# EAGLE design wolf_rev_d (EAGLE 7.6.0)
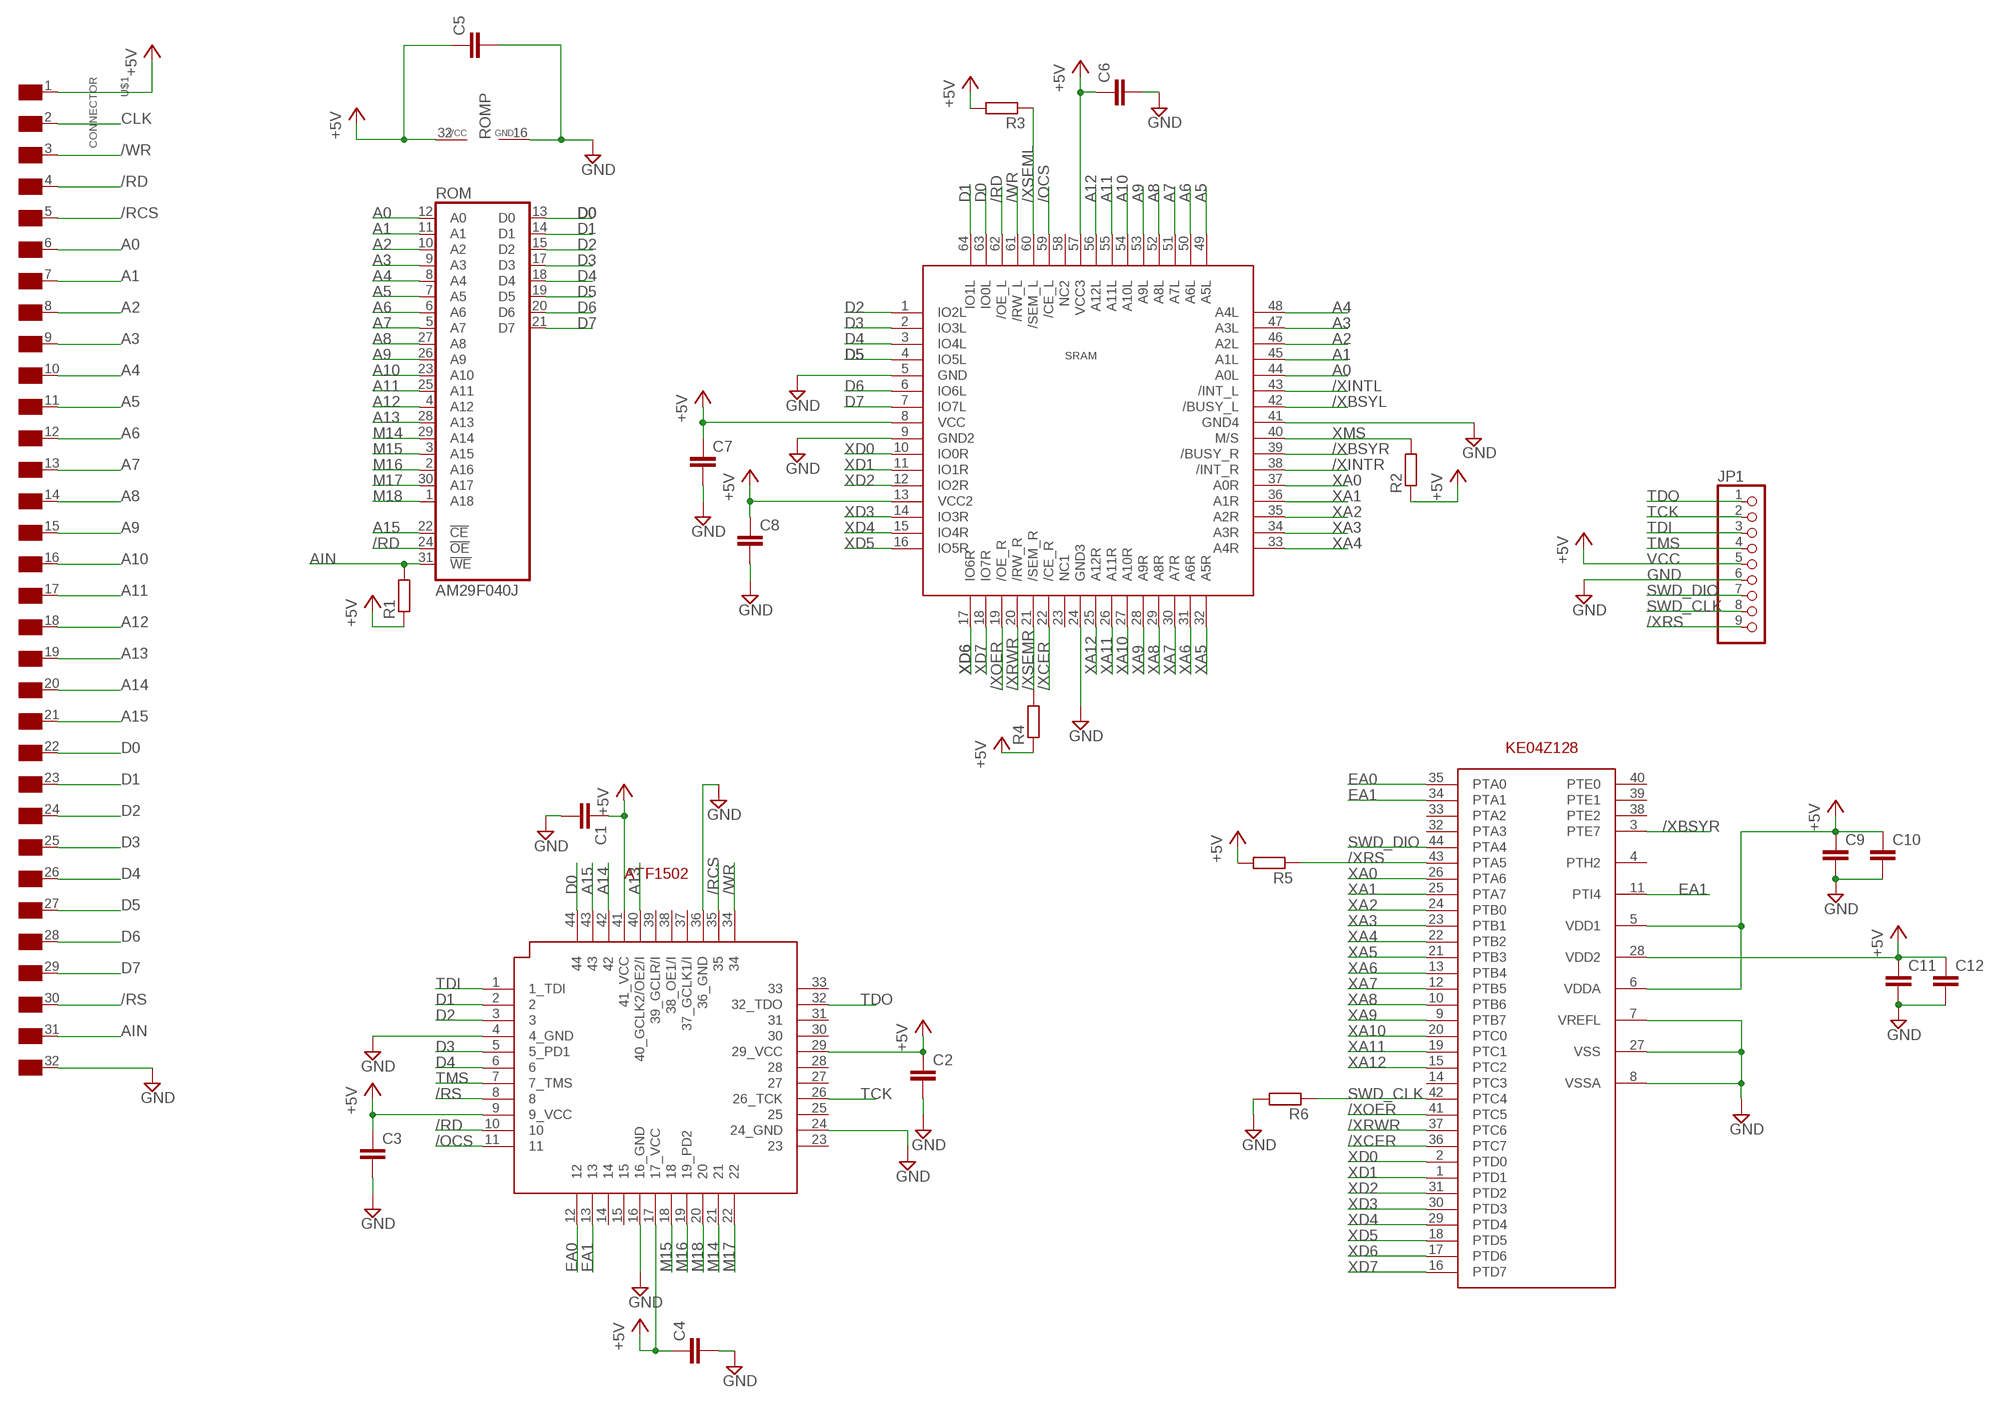
[diagram p0: schematic, sheet 1]

## Parts
ATF1502  ATF1502  [TQFP44]
C1  C-EUC0805  [C0805]
C2  C-EUC0805  [C0805]
C3  C-EUC0805  [C0805]
C4  C-EUC0805  [C0805]
C5  C-EUC0805  [C0805]
C6  C-EUC0805  [C0805]
C7  C-EUC0805  [C0805]
C8  C-EUC0805  [C0805]
C9  C-EUC0805  [C0805]
C10  C-EUC0805  [C0805]
C11  C-EUC0805  [C0805]
C12  C-EUC0805  [C0805]
JP1  PINHD-1X9  [1X09]
KE04Z128  KE04Z128  KE04Z128VLD4  [TQFP44]
R1  R-EU_R0805  [R0805]
R2  R-EU_R0805  [R0805]
R3  R-EU_R0805  [R0805]
R4  R-EU_R0805  [R0805]
R5  R-EU_R0805  [R0805]
R6  R-EU_R0805  [R0805]
ROM  AM29F040J  [PLCC32R]
SRAM  CY7C144E  [TQFP64]
U$1  CONNECTOR  [CONNECTOR]

## Nets
+5V [pwr]: ATF1502.9(9_VCC) ATF1502.17(17_VCC) ATF1502.29(29_VCC) ATF1502.41(41_VCC) C1.1 C2.1 C3.1 C4.1 C5.1 C6.1 C7.1 C8.1 C9.1 C10.1 C11.1 C12.1 JP1.5 KE04Z128.5(VDD1) KE04Z128.6(VDDA) KE04Z128.28(VDD2) R1.1 R2.1 R3.2 R4.1 R5.2 ROM.32(VCC) SRAM.8(VCC) SRAM.13(VCC2) SRAM.57(VCC3) U$1.1(VDD)
/OCS: ATF1502.11 SRAM.59(/CE_L)
/RCS: ATF1502.35 U$1.5(/RCS)
/RD: ATF1502.10 ROM.24(!OE) SRAM.62(/OE_L) U$1.4(/RD)
/RS: ATF1502.8 U$1.30(/RS)
/WR: ATF1502.34 SRAM.61(/RW_L) U$1.3(/WR)
/XBSYL: SRAM.42(/BUSY_L)
/XBSYR: KE04Z128.3(PTE7) SRAM.39(/BUSY_R)
/XCER: KE04Z128.36(PTC7) SRAM.22(/CE_R)
/XINTL: SRAM.43(/INT_L)
/XINTR: SRAM.38(/INT_R)
/XOER: KE04Z128.41(PTC5) SRAM.19(/OE_R)
/XRS: JP1.9 KE04Z128.43(PTA5) R5.1
/XRWR: KE04Z128.37(PTC6) SRAM.20(/RW_R)
/XSEML: R3.1 SRAM.60(/SEM_L)
/XSEMR: R4.2 SRAM.21(/SEM_R)
A0: ROM.12(A0) SRAM.44(A0L) U$1.6(A0)
A1: ROM.11(A1) SRAM.45(A1L) U$1.7(A1)
A2: ROM.10(A2) SRAM.46(A2L) U$1.8(A2)
A3: ROM.9(A3) SRAM.47(A3L) U$1.9(A3)
A4: ROM.8(A4) SRAM.48(A4L) U$1.10(A4)
A5: ROM.7(A5) SRAM.49(A5L) U$1.11(A5)
A6: ROM.6(A6) SRAM.50(A6L) U$1.12(A6)
A7: ROM.5(A7) SRAM.51(A7L) U$1.13(A7)
A8: ROM.27(A8) SRAM.52(A8L) U$1.14(A8)
A9: ROM.26(A9) SRAM.53(A9L) U$1.15(A9)
A10: ROM.23(A10) SRAM.54(A10L) U$1.16(A10)
A11: ROM.25(A11) SRAM.55(A11L) U$1.17(A11)
A12: ROM.4(A12) SRAM.56(A12L) U$1.18(A12)
A13: ATF1502.40(40_GCLK2/OE2/I) ROM.28(A13) U$1.19(A13)
A14: ATF1502.42 U$1.20(A14)
A15: ATF1502.43 ROM.22(!CE) U$1.21(A15)
AIN: R1.2 ROM.31(!WE) U$1.31(VIN)
CLK: U$1.2(NC)
D0: ATF1502.44 ROM.13(D0) SRAM.63(IO0L) U$1.22(D0)
D1: ATF1502.2 ROM.14(D1) SRAM.64(IO1L) U$1.23(D1)
D2: ATF1502.3 ROM.15(D2) SRAM.1(IO2L) U$1.24(D2)
D3: ATF1502.5(5_PD1) ROM.17(D3) SRAM.2(IO3L) U$1.25(D3)
D4: ATF1502.6 ROM.18(D4) SRAM.3(IO4L) U$1.26(D4)
D5: ROM.19(D5) SRAM.4(IO5L) U$1.27(D5)
D6: ROM.20(D6) SRAM.6(IO6L) U$1.28(D6)
D7: ROM.21(D7) SRAM.7(IO7L) U$1.29(D7)
EA0: ATF1502.12 KE04Z128.35(PTA0)
EA1: ATF1502.13 KE04Z128.11(PTI4) KE04Z128.34(PTA1)
GND [gnd]: ATF1502.4(4_GND) ATF1502.16(16_GND) ATF1502.24(24_GND) ATF1502.36(36_GND) C1.2 C2.2 C3.2 C4.2 C5.2 C6.2 C7.2 C8.2 C9.2 C10.2 C11.2 C12.2 JP1.6 KE04Z128.7(VREFL) KE04Z128.8(VSSA) KE04Z128.27(VSS) R6.2 ROM.16(GND) SRAM.5(GND) SRAM.9(GND2) SRAM.24(GND3) SRAM.41(GND4) U$1.32(GND)
M14: ATF1502.21 ROM.29(A14)
M15: ATF1502.18 ROM.3(A15)
M16: ATF1502.19(19_PD2) ROM.2(A16)
M17: ATF1502.22 ROM.30(A17)
M18: ATF1502.20 ROM.1(A18)
SWD_CLK: JP1.8 KE04Z128.42(PTC4) R6.1
SWD_DIO: JP1.7 KE04Z128.44(PTA4)
TCK: ATF1502.26(26_TCK) JP1.2
TDI: ATF1502.1(1_TDI) JP1.3
TDO: ATF1502.32(32_TDO) JP1.1
TMS: ATF1502.7(7_TMS) JP1.4
XA0: KE04Z128.26(PTA6) SRAM.37(A0R)
XA1: KE04Z128.25(PTA7) SRAM.36(A1R)
XA2: KE04Z128.24(PTB0) SRAM.35(A2R)
XA3: KE04Z128.23(PTB1) SRAM.34(A3R)
XA4: KE04Z128.22(PTB2) SRAM.33(A4R)
XA5: KE04Z128.21(PTB3) SRAM.32(A5R)
XA6: KE04Z128.13(PTB4) SRAM.31(A6R)
XA7: KE04Z128.12(PTB5) SRAM.30(A7R)
XA8: KE04Z128.10(PTB6) SRAM.29(A8R)
XA9: KE04Z128.9(PTB7) SRAM.28(A9R)
XA10: KE04Z128.20(PTC0) SRAM.27(A10R)
XA11: KE04Z128.19(PTC1) SRAM.26(A11R)
XA12: KE04Z128.15(PTC2) SRAM.25(A12R)
XD0: KE04Z128.2(PTD0) SRAM.10(IO0R)
XD1: KE04Z128.1(PTD1) SRAM.11(IO1R)
XD2: KE04Z128.31(PTD2) SRAM.12(IO2R)
XD3: KE04Z128.30(PTD3) SRAM.14(IO3R)
XD4: KE04Z128.29(PTD4) SRAM.15(IO4R)
XD5: KE04Z128.18(PTD5) SRAM.16(IO5R)
XD6: KE04Z128.17(PTD6) SRAM.17(IO6R)
XD7: KE04Z128.16(PTD7) SRAM.18(IO7R)
XMS: R2.2 SRAM.40(M/S)
Unconnected: ATF1502.14 ATF1502.15 ATF1502.23 ATF1502.25 ATF1502.27 ATF1502.28 ATF1502.30 ATF1502.31 ATF1502.33 ATF1502.37(37_GCLK1/I) ATF1502.38(38_OE1/I) ATF1502.39(39_GCLR/I) KE04Z128.4(PTH2) KE04Z128.14(PTC3) KE04Z128.32(PTA3) KE04Z128.33(PTA2) KE04Z128.38(PTE2) KE04Z128.39(PTE1) KE04Z128.40(PTE0) SRAM.23(NC1) SRAM.58(NC2)

## Notes on the sheet
- VCC
- GND

## Library data of the parts
ATF1502 = wolf_rev_d:ATF1502
C1-C12 = resistor:C-EU: CAPACITOR, European symbol
JP1 = pinhead:PINHD-1X9: PIN HEADER
KE04Z128 = wolf_rev_c:KE04Z128VLD4
R1-R6 = resistor:R-EU_: RESISTOR, European symbol
ROM = am29-memory:AM29F040J: 4-Megabit FLASH MEMORY (512 K x 8 bit) 5 V-only
SRAM = wolf_rev_c:CY7C144E
U$1 = gameboy:CONNECTOR: Connector Pads for Gameboy Cartridges

## Net classes
1 pwr: width 0.406 mm
2 gnd: width 0.406 mm

## Board
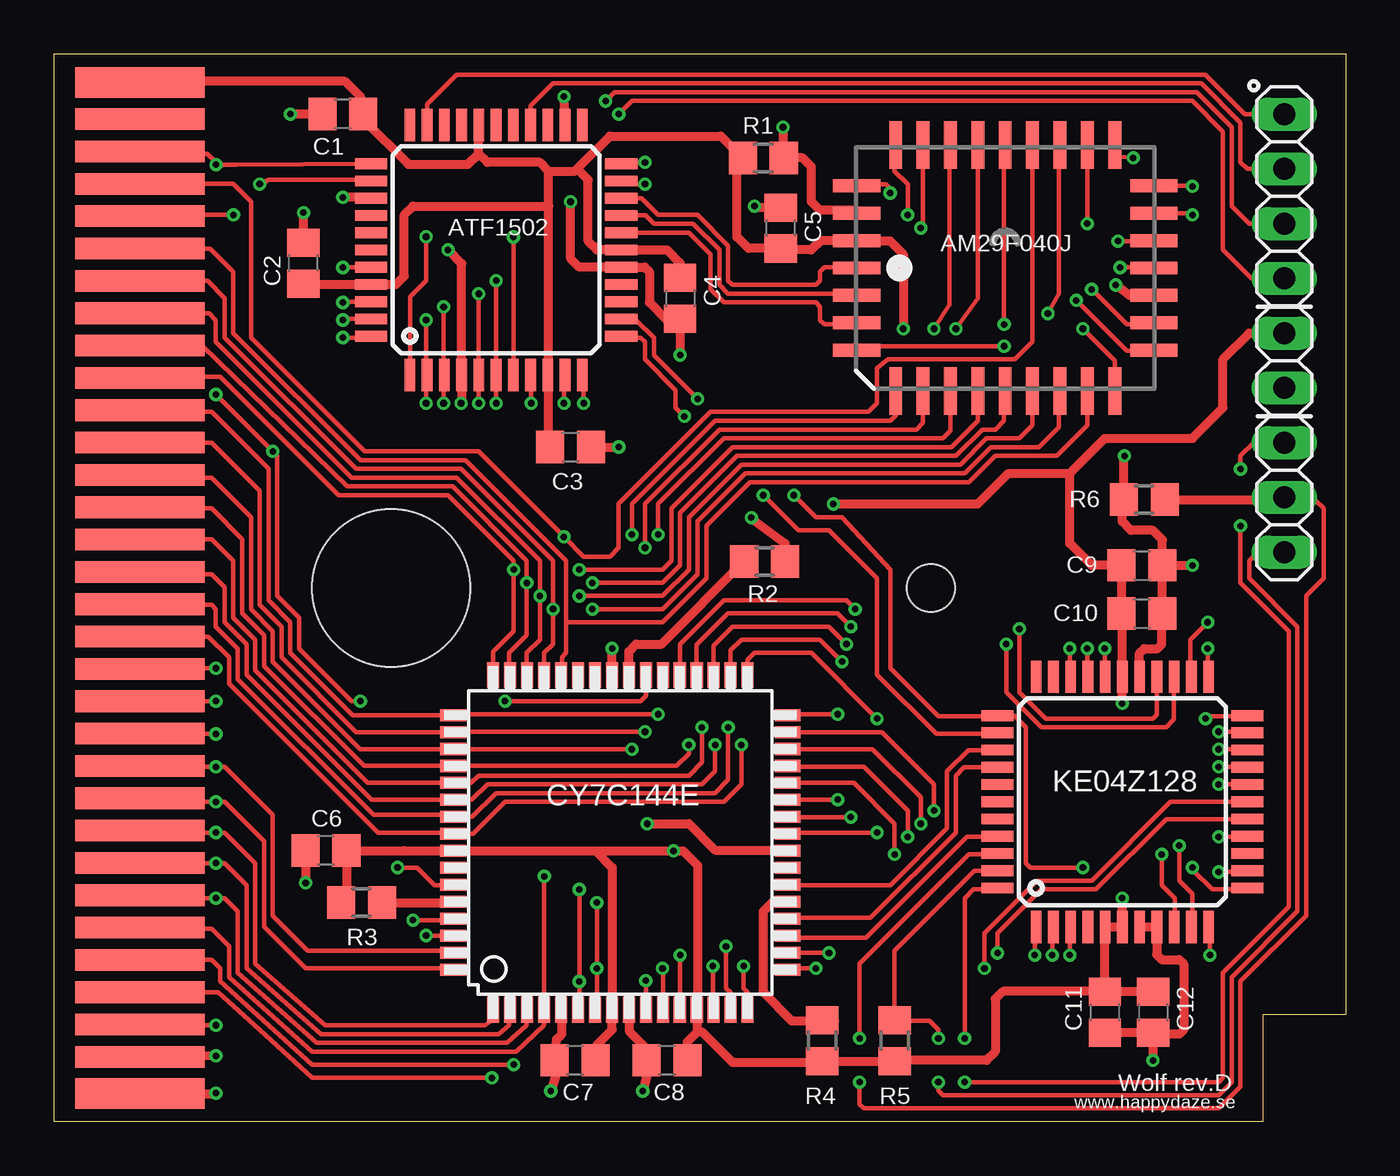
[diagram p1: board, top side]
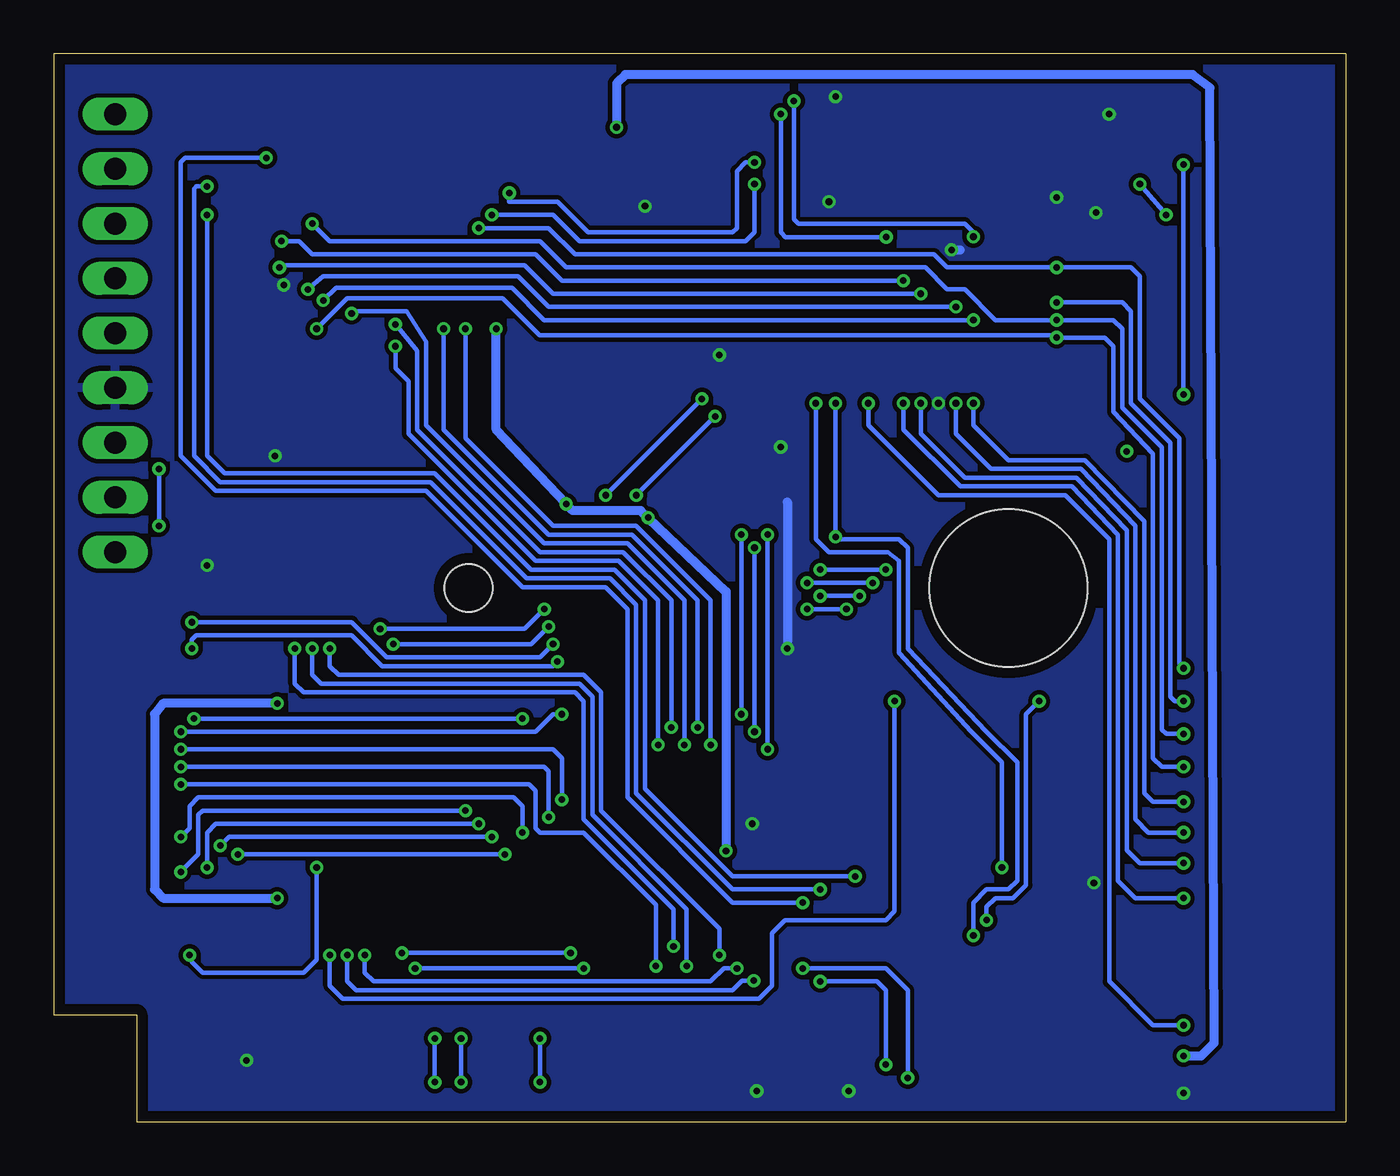
[diagram p2: board, bottom side, seen from below]

Size 59.94 x 49.53 mm. Coordinates in mm from the lower left corner, seen from the top.
Outline: 59.94,4.95 56.11,4.95 56.11,0 0,0 0,49.53 59.94,49.53 59.94,4.95
Copper layers (1*16): Top 0.035mm / dielectric 1.6mm / Bottom 0.035mm
Design rules "Elecrow_2-layer_PCB_eagle_rule *": minimum track width 8mil, minimum drill 12mil, track to track 8mil, track to pad 8mil, pad to pad 8mil, via to via 8mil, smd to smd 0mil, copper to edge 20mil, drill to drill 10mil, minimum pad ring 6mil, minimum via ring 6mil, stop-mask expansion 0mil, vias tented up to drill 100mil, thermal gap 10mil
Holes 7.3 mm at 15.65,24.75
Holes 2.2 mm at 40.7,24.75

### Footprints (pad centres in the part's own frame; a part is rotated, then mirrored left to right if it is on the bottom)
TQFP44 = smd 1.5 x 0.5: 1 -5.8,4; 2 -5.8,3.2; 3 -5.8,2.4; 4 -5.8,1.6; 5 -5.8,0.8; 6 -5.8,0; 7 -5.8,-0.8; 8 -5.8,-1.6; 9 -5.8,-2.4; 10 -5.8,-3.2; 11 -5.8,-4; 23 5.8,-4; 24 5.8,-3.2; 25 5.8,-2.4; 26 5.8,-1.6; 27 5.8,-0.8; 28 5.8,0; 29 5.8,0.8; 30 5.8,1.6; 31 5.8,2.4; 32 5.8,3.2; 33 5.8,4 | smd 0.5 x 1.5: 12 -4,-5.8; 13 -3.2,-5.8; 14 -2.4,-5.8; 15 -1.6,-5.8; 16 -0.8,-5.8; 17 0,-5.8; 18 0.8,-5.8; 19 1.6,-5.8; 20 2.4,-5.8; 21 3.2,-5.8; 22 4,-5.8; 34 4,5.8; 35 3.2,5.8; 36 2.4,5.8; 37 1.6,5.8; 38 0.8,5.8; 39 0,5.8; 40 -0.8,5.8; 41 -1.6,5.8; 42 -2.4,5.8; 43 -3.2,5.8; 44 -4,5.8
C0805 = smd 1.3 x 1.5: 1 -0.95,0; 2 0.95,0
1X09 = drill 1.016 long: 1 -10.16,0; 2 -7.62,0; 3 -5.08,0; 4 -2.54,0; 5 0,0; 6 2.54,0; 7 5.08,0; 8 7.62,0; 9 10.16,0
R0805 = smd 1.3 x 1.5: 1 -0.95,0; 2 0.95,0
PLCC32R = smd 0.6 x 2.2: 1 0,6.9; 2 -1.27,6.9; 3 -2.54,6.9; 4 -3.81,6.9; 14 -3.81,-6.9; 15 -2.54,-6.9; 16 -1.27,-6.9; 17 0,-6.9; 18 1.27,-6.9; 19 2.54,-6.9; 20 3.81,-6.9; 30 3.81,6.9; 31 2.54,6.9; 32 1.27,6.9 | smd 2.2 x 0.6: 5 -5.7,5.08; 6 -5.7,3.81; 7 -5.7,2.54; 8 -5.7,1.27; 9 -5.7,0; 10 -5.7,-1.27; 11 -5.7,-2.54; 12 -5.7,-3.81; 13 -5.7,-5.08; 21 5.7,-5.08; 22 5.7,-3.81; 23 5.7,-2.54; 24 5.7,-1.27; 25 5.7,0; 26 5.7,1.27; 27 5.7,2.54; 28 5.7,3.81; 29 5.7,5.08
TQFP64 = smd 1.194 x 0.559: 1 -7.76,5.905; 2 -7.76,5.118; 3 -7.76,4.331; 4 -7.76,3.543; 5 -7.76,2.756; 6 -7.76,1.968; 7 -7.76,1.181; 8 -7.76,0.394; 9 -7.76,-0.394; 10 -7.76,-1.181; 11 -7.76,-1.968; 12 -7.76,-2.756; 13 -7.76,-3.543; 14 -7.76,-4.331; 15 -7.76,-5.118; 16 -7.76,-5.905; 33 7.76,-5.905; 34 7.76,-5.118; 35 7.76,-4.331; 36 7.76,-3.543; 37 7.76,-2.756; 38 7.76,-1.968; 39 7.76,-1.181; 40 7.76,-0.394; 41 7.76,0.394; 42 7.76,1.181; 43 7.76,1.968; 44 7.76,2.756; 45 7.76,3.543; 46 7.76,4.331; 47 7.76,5.118; 48 7.76,5.905 | smd 0.559 x 1.194: 17 -5.905,-7.76; 18 -5.118,-7.76; 19 -4.331,-7.76; 20 -3.543,-7.76; 21 -2.756,-7.76; 22 -1.968,-7.76; 23 -1.181,-7.76; 24 -0.394,-7.76; 25 0.394,-7.76; 26 1.181,-7.76; 27 1.968,-7.76; 28 2.756,-7.76; 29 3.543,-7.76; 30 4.331,-7.76; 31 5.118,-7.76; 32 5.905,-7.76; 49 5.905,7.76; 50 5.118,7.76; 51 4.331,7.76; 52 3.543,7.76; 53 2.756,7.76; 54 1.968,7.76; 55 1.181,7.76; 56 0.394,7.76; 57 -0.394,7.76; 58 -1.181,7.76; 59 -1.968,7.76; 60 -2.756,7.76; 61 -3.543,7.76; 62 -4.331,7.76; 63 -5.118,7.76; 64 -5.905,7.76
CONNECTOR = smd 1.4 x 6: 1 0.7,-3; 32 47.6,-3 | smd 1 x 6: 2 2.4,-3; 3 3.9,-3; 4 5.4,-3; 5 6.9,-3; 6 8.4,-3; 7 9.9,-3; 8 11.4,-3; 9 12.9,-3; 10 14.4,-3; 11 15.9,-3; 12 17.4,-3; 13 18.9,-3; 14 20.4,-3; 15 21.9,-3; 16 23.4,-3; 17 24.9,-3; 18 26.4,-3; 19 27.9,-3; 20 29.4,-3; 21 30.9,-3; 22 32.4,-3; 23 33.9,-3; 24 35.4,-3; 25 36.9,-3; 26 38.4,-3; 27 39.9,-3; 28 41.4,-3; 29 42.9,-3; 30 44.4,-3; 31 45.9,-3

### Placement (x,y rotation side)
ATF1502  20.52,40.44 90 top
C1  13.41,46.74 180 top
C2  11.58,39.83 90 top
C3  23.98,31.29 0 top
C4  29.06,38.2 270 top
C5  33.73,41.45 90 top
C6  12.62,12.57 180 top
C7  24.18,2.84 180 top
C8  28.45,2.84 180 top
C9  50.5,25.81 0 top
C10  50.5,23.57 0 top
C11  48.77,5.08 270 top
C12  51,5.08 270 top
JP1  57.1,36.58 270 top
KE04Z128  49.58,14.83 90 top
R1  32.92,44.7 0 top
R2  32.99,25.99 180 top
R3  14.27,10.16 180 top
R4  35.66,3.76 90 top
R5  39.01,3.76 270 top
R6  50.6,28.85 180 top
ROM  44.15,39.6 90 top
SRAM  26.29,12.95 90 top
U$1  7,48.9 270 top

### Tracks (layer width: path | path; a pad name or v marks a point on that pad's centre or on a via)
+5V  (via drill 0.3 pad 0.3)
  Top 0.406: C7.1 25.21,3.57 25.91,4.27 SRAM.8 25.91,5.21 25.91,11.79 25.13,12.56 | C8.1 29.4,3.69 29.87,4.17 | 29.87,4.17 29.87,5.16 SRAM.13 29.87,5.23 29.87,11.89 29.2,12.56 v28.75,12.56 25.13,12.56 | 16.26,12.57 C6.1 13.57,9.81 R3.2 | 16.26,12.57 18.52,12.57 SRAM.57 25.13,12.56 | 16.24,12.56 16.26,12.57 | v36.17,28.65 42.88,28.65 44.3,30.07 47.14,30.07 | v32.37,28.02 32.33,28.02 33.93,26.82 R2.1 | 29.87,4.17 30.07,4.17 31.5,2.74 36.2,2.74 R4.1 R5.2 39.66,2.85 43.28,2.85 43.69,3.25 43.69,5.69 44.04,6.04 48.78,6.04 | C9.1 C10.1 49.58,23.54 KE04Z128.28 | C12.1 C11.1 48.78,6.04 | 49.58,25.84 C9.1 | JP1.5 55.47,36.58 54.25,35.36 54.25,33.12 52.83,31.7 48.77,31.7 47.14,30.07 | 49.55,20.67 KE04Z128.28 | v49.58,19.41 KE04Z128.28 | KE04Z128.6 49.58,8.94 | KE04Z128.6 KE04Z128.5 48.78,6.04 | KE04Z128.6 v49.58,10.36 | v39.42,36.78 39.42,40.23 38.81,40.84 37.27,40.84 ROM.32 35.59,40.87 35.15,40.44 34,40.44 C5.1 32.24,40.5 31.7,41.05 31.7,44.64 R1.1 30.95,45.72 25.81,45.72 24.28,44.2 | C2.1 11.65,38.81 14.63,38.81 14.66,38.84 ATF1502.41 15.88,38.84 16.26,39.22 16.26,42.06 16.66,42.47 22.96,42.47 | C3.1 22.92,31.4 ATF1502.9 22.96,34.67 22.96,42.47 | C4.1 29.06,39.83 28.45,40.44 ATF1502.17 25.2,40.44 24.79,40.84 24.79,43.69 24.28,44.2 | 19.71,44.91 19.71,46.22 ATF1502.29 | 19.71,44.91 20.12,44.5 22.55,44.5 22.96,44.09 | 22.96,42.47 22.96,44.09 | U$1.1 4.06,48.26 13.51,48.26 14.22,47.55 14.22,46.87 C1.1 14.36,46.5 16.46,44.4 19.2,44.4 19.71,44.91 | 22.96,44.09 24.18,44.09 24.28,44.2 | C9.1 48.16,25.81 47.14,26.82 47.14,30.07
  Bottom 0.406: v28.75,12.56 28.75,24.59 v32.37,28.02 32.72,28.35 35.87,28.35 v36.17,28.65 39.42,32.11 v39.42,36.78 | v49.58,19.41 54.86,19.41 55.27,18.9 55.27,10.77 54.86,10.36 v49.58,10.36
/OCS  (via drill 0.3 pad 0.3)
  Top 0.203: SRAM.59 18.52,10.97 17.68,10.97 16.87,11.79 v15.95,11.79 | v24.59,33.33 24.59,34.57 ATF1502.11
  Bottom 0.203: v15.95,11.79 15.95,16.66 17.37,18.09 20.73,21.74 20.73,26.01 21.23,26.42 23.98,26.42 24.59,27.03 v24.59,33.33
/RCS  (via drill 0.3 pad 0.3)
  Top 0.203: v8.33,42.06 4.06,42.06 U$1.5 | v9.55,43.48 9.96,43.69 14.67,43.69 ATF1502.35
  Bottom 0.203: v8.33,42.06 v9.55,43.48
/RD  (via drill 0.3 pad 0.3)
  Top 0.203: U$1.4 8.32,43.5 9.14,42.67 9.14,36.37 14.43,31.09 19.71,31.09 v23.67,27.13 24.59,26.21 25.81,26.21 26.21,26.62 26.21,28.65 30.48,32.92 37.8,32.92 38.2,33.33 38.2,34.95 38.71,35.36 44.6,35.36 45.41,36.17 ROM.24 | SRAM.62 17.29,8.62 v17.27,8.64 | v23.67,33.33 23.67,34.59 ATF1502.10
  Bottom 0.203: v17.27,8.64 17.27,10.16 16.66,10.77 15.65,10.77 15.24,11.18 15.24,16.66 16.66,18.09 20.32,21.95 20.32,26.62 20.73,27.03 23.57,27.03 v23.67,27.13 v23.67,33.33
/RS  (via drill 0.3 pad 0.3)
  Top 0.203: v22.15,33.33 22.15,34.61 ATF1502.8 | v7.52,4.47 4.03,4.47 U$1.30
  Bottom 0.203: v7.52,4.47 8.94,4.47 10.97,6.5 10.97,27.03 13.01,29.06 18.9,29.06 22.15,32.31 v22.15,33.33
/WR  (via drill 0.3 pad 0.3)
  Top 0.203: v7.52,33.73 v10.16,31.09 10.36,30.89 10.36,24.38 11.38,23.37 11.38,21.95 13.82,19.51 v14.22,19.51 | v16.66,9.35 18.47,9.35 SRAM.61 | ATF1502.34 8.47,44.39 v7.53,44.39 7.53,44.49 7.11,44.91 4.09,44.91 U$1.3
  Bottom 0.203: v7.53,44.39 7.53,33.52 v7.52,33.73 | v16.66,9.35 16.66,9.96 16.26,10.36 15.44,10.36 14.83,10.97 14.83,18.9 v14.22,19.51
/XBSYR  (via drill 0.3 pad 0.3)
  Top 0.203: v47.14,7.72 47.14,8.99 KE04Z128.3 | SRAM.39 27.47,19.75 27.23,19.51 v20.93,19.51
  Bottom 0.203: v47.14,7.72 47.14,6.3 46.53,5.69 27.23,5.69 26.62,6.3 26.62,8.74 26.01,9.35 21.34,9.35 20.93,9.75 v20.93,19.51
/XCER
  Top 0.203: KE04Z128.36 42.43,17.23 41.45,16.26 41.45,13.61 38.81,10.97 34.06,10.97 SRAM.22
/XOER
  Top 0.203: SRAM.19 34.14,8.53 37.69,8.53 42.37,13.21 43.76,13.21 KE04Z128.41
/XRS  (via drill 0.3 pad 0.3)
  Top 0.203: KE04Z128.43 42.72,11.63 39.01,7.92 R5.1 39.05,4.67 40.64,4.67 41.05,4.27 v41.05,3.86 | JP1.9 55.88,26.42 55.47,26.01 55.47,25.2 57.71,22.96 57.71,9.75 54.66,6.71 54.66,1.83 54.05,1.22 41.25,1.22 41.05,1.42 v41.05,1.83
  Bottom 0.203: v41.05,1.83 v41.05,3.86
/XRWR
  Top 0.203: KE04Z128.37 42.24,16.43 41.86,16.05 41.86,13.41 37.9,9.45 34.09,9.45 SRAM.20 34.11,9.35
/XSEML
  Top 0.406: R3.1 18.49,10.16 SRAM.60
/XSEMR
  Top 0.406: SRAM.21 34.01,10.16 33.33,10.16 32.92,9.75 32.92,5.99 34.24,4.67 36.24,4.67 R4.2
A0
  Top 0.203: U$1.6 7.25,40.5 8.33,39.42 8.33,36.58 14.22,30.68 19.1,30.68 23.77,26.01 23.77,23.16 | SRAM.44 23.57,20.75 23.57,21.54 23.77,21.74 23.77,23.16 | ROM.12 47.95,32.31 46.53,30.89 43.69,30.89 42.47,29.67 32.31,29.67 30.28,27.64 30.28,25.2 28.25,23.16 23.77,23.16
A1  (via drill 0.3 pad 0.3)
  Top 0.203: U$1.7 7.13,39 7.92,38.2 7.92,36.37 14.02,30.28 18.9,30.28 23.16,26.01 v23.16,23.77 23.16,22.15 22.76,21.74 22.76,20.73 SRAM.45 | ROM.11 46.63,33.85 46.63,32.21 45.72,31.29 43.48,31.29 42.27,30.07 32.11,30.07 29.87,27.84 29.87,25.4 28.25,23.77 v24.99,23.77
  Bottom 0.203: v23.16,23.77 v24.99,23.77
A2  (via drill 0.3 pad 0.3)
  Top 0.203: U$1.8 7.2,37.5 7.52,37.19 7.52,36.17 13.82,29.87 18.69,29.87 22.55,26.01 v22.55,24.38 22.55,22.35 21.95,21.74 21.95,20.73 SRAM.46 | ROM.10 45.41,32.31 44.81,31.7 43.28,31.7 42.06,30.48 31.9,30.48 29.46,28.04 29.46,25.6 28.25,24.38 v24.38,24.38
  Bottom 0.203: v22.55,24.38 v24.38,24.38
A3  (via drill 0.3 pad 0.3)
  Top 0.203: U$1.9 6.88,36 13.61,29.46 18.49,29.46 21.95,26.01 v21.95,24.99 21.95,22.55 21.13,21.74 21.13,20.75 SRAM.47 | ROM.9 44.09,33.85 44.09,32.51 43.69,32.11 43.08,32.11 41.86,30.89 31.7,30.89 29.06,28.25 29.06,25.81 28.25,24.99 v24.99,24.99
  Bottom 0.203: v21.95,24.99 v24.99,24.99
A4  (via drill 0.3 pad 0.3)
  Top 0.203: U$1.10 4.04,34.54 7.72,34.54 13.21,29.06 18.29,29.06 21.34,26.01 v21.34,25.6 21.34,22.76 20.38,21.81 SRAM.48 | ROM.8 42.88,32.51 41.66,31.29 31.5,31.29 28.65,28.45 28.65,26.01 28.25,25.6 v24.38,25.6
  Bottom 0.203: v21.34,25.6 v24.38,25.6
A5  (via drill 0.3 pad 0.3)
  Top 0.203: U$1.11 4.08,32.92 7.32,32.92 9.96,30.28 9.96,24.18 10.97,23.16 10.97,21.74 13.86,18.86 SRAM.49 18.57,18.9 v28.04,18.9 | ROM.7 41.6,32.05 41.25,31.7 31.09,31.7 28.04,28.65 v28.04,27.23
  Bottom 0.203: v28.04,27.23 v28.04,18.9
A6  (via drill 0.3 pad 0.3)
  Top 0.203: U$1.12 7.32,31.5 9.55,29.26 9.55,23.98 10.57,22.96 10.57,21.54 14.03,18.07 SRAM.50 18.54,18.09 v27.43,18.09 | ROM.6 40.34,32.41 40.03,32.11 30.89,32.11 27.43,28.65 v27.43,26.62
  Bottom 0.203: v27.43,26.62 v27.43,18.09
A7  (via drill 0.3 pad 0.3)
  Top 0.203: U$1.13 4.13,29.87 7.32,29.87 9.14,28.04 9.14,23.77 10.16,22.76 10.16,21.34 14.21,17.29 SRAM.51 18.54,17.27 v26.82,17.27 | ROM.5 39.06,32.77 38.81,32.51 30.68,32.51 26.82,28.65 v26.82,27.23
  Bottom 0.203: v26.82,27.23 v26.82,17.27
A8  (via drill 0.3 pad 0.3)
  Top 0.203: 3.95,28.45 7.32,28.45 8.74,27.03 8.74,23.57 9.75,22.55 9.75,21.13 14.39,16.5 SRAM.52 28.89,16.5 29.46,17.07 v29.46,17.48 | 3.45,28.45 3.95,28.45 | 3.95,28.45 U$1.14 | v40.84,36.78 41.55,37.9 41.55,45.25 ROM.27
  Bottom 0.203: v29.46,17.48 29.46,24.18 32.92,27.64 36.78,27.64 40.84,31.7 v40.84,36.78
A9  (via drill 0.3 pad 0.3)
  Top 0.203: U$1.15 4.03,27.03 7.32,27.03 8.33,26.01 8.33,23.37 9.35,22.35 9.35,20.93 14.57,15.71 SRAM.53 19.37,15.71 19.71,16.05 29.46,16.05 30.07,16.66 v30.07,18.29 | v41.86,36.78 42.88,38.2 ROM.26
  Bottom 0.203: v30.07,18.29 30.07,24.18 33.12,27.23 36.98,27.23 41.86,32.11 v41.86,36.78
A10  (via drill 0.3 pad 0.3)
  Top 0.203: U$1.16 4.1,25.4 7.32,25.4 7.92,24.79 7.92,23.16 8.94,22.15 8.94,20.73 14.74,14.92 SRAM.54 19.39,14.92 20.12,15.65 30.07,15.65 30.68,16.26 v30.68,17.48 | v46.13,37.49 46.63,38.41 46.63,45.25 ROM.23 46.74,45.25
  Bottom 0.203: v30.68,17.48 30.68,24.18 33.33,26.82 37.19,26.82 42.67,32.31 42.67,36.17 43.59,37.59 46.02,37.59 v46.13,37.49
A11  (via drill 0.3 pad 0.3)
  Top 0.203: U$1.17 4.02,23.98 7.32,23.98 7.52,23.77 7.52,22.96 8.53,21.95 8.53,20.52 14.83,14.22 18.44,14.22 SRAM.55 19.42,14.13 20.52,15.24 30.68,15.24 31.29,15.85 v31.29,18.29 | v44.09,36.98 44.09,45.25 ROM.25
  Bottom 0.203: v31.29,18.29 31.29,24.18 33.53,26.42 37.39,26.42 43.08,32.11 43.08,35.76 v44.09,36.98
A12  (via drill 0.3 pad 0.3)
  Top 0.203: U$1.18 7.17,22.5 8.13,21.54 8.13,20.32 15.04,13.41 18.47,13.41 SRAM.56 19.44,13.35 20.93,14.83 31.09,14.83 31.9,15.65 v31.9,17.48 | v44.09,35.97 38,35.97 37.8,35.76 37.27,35.76 ROM.4
  Bottom 0.203: v31.9,17.48 31.9,24.18 33.73,26.01 37.59,26.01 43.48,31.9 43.48,34.34 44.09,34.95 v44.09,35.97
A13  (via drill 0.3 pad 0.3)
  Top 0.203: v7.52,21.03 4.03,21.03 U$1.19 | ATF1502.40 13.42,39.64 v13.41,39.62 | ROM.28 40.34,41.55 v40.23,41.45
  Bottom 0.203: v7.52,21.03 7.72,21.23 7.72,31.7 9.55,33.53 9.55,39.22 9.96,39.62 v13.41,39.62 18.49,39.62 19.1,40.23 35.76,40.23 36.98,41.45 v40.23,41.45
A14  (via drill 0.3 pad 0.3)
  Top 0.203: v7.52,19.51 U$1.20 | ATF1502.42 13.65,38.04 v13.41,38
  Bottom 0.203: v7.52,19.51 7.92,19.51 8.13,19.71 8.13,31.5 9.96,33.33 9.96,37.59 10.36,38 v13.41,38
A15  (via drill 0.3 pad 0.3)
  Top 0.203: v7.52,17.98 4.02,17.98 U$1.21 | v13.41,37.19 13.67,37.24 ATF1502.43 14.77,37.19 | ROM.22 v47.95,41.66
  Bottom 0.203: v7.52,17.98 8.33,17.98 8.53,18.19 8.53,31.29 10.36,33.12 10.36,36.78 10.77,37.19 v13.41,37.19 16.26,37.19 17.68,38.61 18.49,38.61 19.51,39.62 36.17,39.62 37.39,40.84 47.14,40.84 v47.95,41.66
AIN  (via drill 0.3 pad 0.3)
  Top 0.203: 37.12,42.27 ROM.31
  Top 0.406: 37.22,42.16 ROM.31 | v7.52,3.05 7.5,3.05 U$1.31 | v33.83,46.13 33.83,44.74 R1.2 34.75,44.7 35.15,44.3 35.15,42.67 35.56,42.27 37.12,42.27
  Bottom 0.406: v7.52,3.05 7.5,3.03 6.71,3.03 6.1,3.65 6.3,47.95 7.11,48.56 33.43,48.56 33.83,48.16 v33.83,46.13
D0  (via drill 0.3 pad 0.3)
  Top 0.203: SRAM.63 18.44,7.92 11.79,7.92 10.16,9.55 10.16,14.22 7.92,16.46 v7.52,16.46 4.04,16.46 U$1.22 | ROM.13 49.23,35.31 v47.75,36.78 | v13.41,36.37 14.66,36.37 ATF1502.44
  Bottom 0.203: v7.52,16.46 8.53,16.46 8.94,16.87 8.94,30.99 10.77,32.92 10.77,35.97 11.18,36.37 v13.41,36.37 13.52,36.48 37.41,36.48 39.12,38.19 39.73,38.2 46.33,38.2 v47.75,36.78
D1  (via drill 0.3 pad 0.3)
  Top 0.203: SRAM.64 18.47,7.11 11.68,7.11 9.75,9.04 9.75,13.01 7.92,14.83 v7.52,14.83 4.17,14.83 U$1.23 | v47.45,38.1 49.78,35.76 51.02,35.76 ROM.14 | v17.27,33.33 17.27,34.59 ATF1502.2 17.27,34.69 v17.27,37.19
  Bottom 0.203: v7.52,14.83 8.94,14.83 9.35,15.24 9.35,27.84 12.09,30.68 15.65,30.68 17.27,32.31 v17.27,33.33 | v17.27,37.19 37.19,37.19 38.69,38.69 46.86,38.69 v47.45,38.1
D2  (via drill 0.3 pad 0.3)
  Top 0.203: SRAM.1 20.32,5.13 20.32,4.67 20.02,4.47 12.6,4.47 9.35,7.32 9.35,11.99 7.92,13.41 v7.52,13.41 4.09,13.41 U$1.24 | ROM.15 50.97,36.98 49.78,36.98 v48.16,38.61 | v18.09,33.33 18.09,34.6 ATF1502.3 18.09,34.67 v18.09,37.8
  Bottom 0.203: v7.52,13.41 9.14,13.41 9.75,14.02 9.75,27.64 12.29,30.28 16.46,30.28 18.09,31.9 v18.09,33.33 | v48.16,38.61 47.45,39.22 38.41,39.22 36.98,37.8 v18.09,37.8
D3  (via drill 0.3 pad 0.3)
  Top 0.203: SRAM.2 21.13,5.16 21.13,4.47 20.62,4.06 12.39,4.06 8.94,7.11 8.94,10.97 7.92,11.99 v7.52,11.99 U$1.25 | v49.48,39.62 51.02,39.62 ROM.17 | v19.71,33.33 19.71,34.62 ATF1502.5 v19.71,38.41
  Bottom 0.203: v7.52,11.99 9.55,11.99 10.16,12.6 10.16,27.43 12.5,29.87 17.68,29.87 19.71,31.9 v19.71,33.33 | v49.48,39.62 49.38,39.62 49.17,39.73 38.1,39.73 36.78,38.41 v19.71,38.41
D4  (via drill 0.3 pad 0.3)
  Top 0.203: SRAM.3 21.95,5.18 21.95,4.47 21.03,3.66 12.19,3.66 8.53,6.91 8.53,9.75 7.92,10.36 v7.52,10.36 4.14,10.36 U$1.26 | 50.62,40.87 ROM.18 51.02,40.84 v49.38,40.84 | v20.52,33.33 ATF1502.6 v20.52,39.01
  Bottom 0.203: v7.52,10.36 9.75,10.36 10.57,11.18 10.57,27.23 12.7,29.46 17.88,29.46 20.52,32.11 v20.52,33.33 | v49.38,40.84 48.56,40.84 47.95,40.23 37.59,40.23 36.37,39.01 v20.52,39.01
D5  (via drill 0.3 pad 0.3)
  Top 0.203: U$1.27 4.21,9 4.27,8.94 7.32,8.94 8.13,8.13 8.13,6.71 11.99,3.25 21.44,3.25 22.76,4.47 SRAM.4 22.76,5.21 v22.76,11.38 | ROM.19 52.76,42.14 v52.83,42.06
  Bottom 0.203: v52.83,42.06 52.83,30.89 52.02,30.07 42.27,30.07 37.8,25.6 33.93,25.6 32.51,24.18 32.51,15.44 28.45,11.38 v22.76,11.38
D6  (via drill 0.3 pad 0.3, 0.3 pad 0.61)
  Top 0.203: U$1.28 7.33,7.5 7.72,7.11 7.72,6.5 11.99,2.64 v21.34,2.64 | ROM.20 52.81,43.41 v52.83,43.38 | SRAM.6 24.38,5.26 v24.38,6.5 v24.38,10.77
  Bottom 0.203: v21.34,2.64 21.34,6.1 21.74,6.5 v24.38,6.5 | v52.83,43.38 53.34,43.38 53.44,43.28 53.44,30.89 52.22,29.67 42.47,29.67 38,25.2 34.14,25.2 32.92,23.98 32.92,15.24 28.45,10.77 v24.38,10.77
D7  (via drill 0.3 pad 0.3, 0.3 pad 0.61)
  Top 0.203: U$1.29 7.61,6 9.55,4.27 11.99,2.03 v20.32,2.03 | 25.09,5.21 SRAM.7 25.2,5.28 v25.2,7.11 v25.2,10.16 | ROM.21 49.43,44.76 v50.09,44.7
  Bottom 0.203: v20.32,2.03 20.32,6.1 21.34,7.11 v25.2,7.11 | v50.09,44.7 53.85,44.7 54.05,44.5 54.05,30.89 52.43,29.26 42.67,29.26 38.2,24.79 34.34,24.79 33.33,23.77 33.33,15.04 28.45,10.16 v25.2,10.16
EA0  (via drill 0.3 pad 0.3)
  Top 0.203: v32.92,29.06 34.54,27.43 35.97,27.43 38.2,25.2 38.2,20.73 40.95,17.98 43.73,17.98 KE04Z128.35 | ATF1502.12 26.39,36.37 27.23,36.37 27.43,36.17 27.43,35.36 28.85,33.93 28.85,33.12 v29.26,32.72
  Bottom 0.203: v32.92,29.06 v29.26,32.72
EA1  (via drill 0.3 pad 0.3)
  Top 0.203: v34.34,29.06 35.36,28.04 36.58,28.04 38.81,25.6 38.81,21.03 41.05,18.8 43.74,18.8 KE04Z128.34 44.56,18.83 45.11,18.29 45.11,11.99 45.31,11.79 v47.75,11.79 | v53.65,7.72 53.65,8.97 KE04Z128.11 | v29.87,33.53 27.84,35.56 27.84,36.37 27.03,37.19 26.37,37.19 ATF1502.13
  Bottom 0.203: v47.75,11.79 47.75,7.52 48.36,6.91 53.03,6.91 53.54,7.42 53.54,7.62 v53.65,7.72 | v34.34,29.06 v29.87,33.53
GND  (via drill 0.3 pad 0.3)
  Top 0.406: SRAM.9 26.72,5.16 26.72,4.17 27.5,3.39 C8.2 27.5,2.1 v27.33,1.42 | 4.08,1.22 U$1.32 7.5,1.3 v7.52,1.32 | SRAM.41 25.89,21.83 v25.91,21.95 | ROM.16 49.91,38.33 v49.28,38.81 | C6.2 11.67,11.29 v11.68,11.07 | SRAM.5 23.57,5.16 23.57,4.06 23.31,3.8 C7.2 23.31,2.17 v23.06,1.42 | v27.53,13.82 29.46,13.82 30.68,12.6 34.01,12.6 SRAM.24 | C9.2 v52.83,25.81 | KE04Z128.7 KE04Z128.8 51.18,7.75 51.41,7.52 52.22,7.52 52.43,7.32 52.43,4.27 52.22,4.06 51.07,4.06 C12.2 | C9.2 C10.2 51.41,23.54 51.41,22.15 51.21,21.95 50.6,21.95 50.38,21.73 KE04Z128.27 | C12.2 C11.2 | C12.2 v51,2.85 | C2.2 v11.58,42.16 | ATF1502.36 14.69,42.88 v13.41,42.88 | C3.2 v26.21,31.29 | v18.9,33.33 18.92,33.55 ATF1502.4 18.92,39.8 v18.29,40.44 | v29.06,35.56 C4.2 28.99,37.19 28.45,37.19 27.64,38 27.64,39.42 27.42,39.64 ATF1502.16 24.37,39.64 23.98,40.03 v23.98,42.67 | C5.2 32.78,42.4 v32.51,42.47 | C1.2 v10.97,46.74 | ATF1502.24 23.72,46.38 v23.67,47.55 | C9.2 51.45,26.99 51,27.43 49.99,27.43 49.58,27.84 49.58,28.99 R6.2 49.65,30.75 v49.68,30.89
  Bottom 0.406: 25.91,28.75 v25.91,21.95 | v18.29,40.44 17.88,40.44
  pour Bottom: 0.2,49.28 59.74,49.28 59.74,5.18 55.68,5.18 55.68,0.2 0.2,0.2
M14  (via drill 0.3 pad 0.3)
  Top 0.203: ROM.29 39.01,45.35 39.01,44.09 39.62,43.48 v39.62,42.06 | ATF1502.21 26.67,43.64 26.82,43.48 v27.43,43.48
  Bottom 0.203: v39.62,42.06 36.78,42.06 35.56,40.84 27.84,40.84 27.43,41.25 v27.43,43.48
M15
  Top 0.203: ATF1502.18 29.48,41.24 30.48,40.23 30.48,38.61 31.09,38 35.36,38 35.56,37.8 35.56,37.19 35.76,36.98 37.17,36.98 ROM.3
M16
  Top 0.203: 36.78,38.2 37.12,38.2 ROM.2 37.17,38.41 31.29,38.41 30.89,38.81 30.89,40.44 29.67,41.66 27.84,41.66 27.46,42.04 ATF1502.19
M17  (via drill 0.3 pad 0.3)
  Top 0.203: 37.17,43.48 ROM.30 37.32,43.48 38.61,43.48 38.81,43.28 v38.81,43.08 | 26.82,44.5 26.76,44.44 ATF1502.22 26.39,44.5 v27.43,44.5
  Bottom 0.203: v38.81,43.08 38.81,42.67 36.58,42.67 35.15,41.25 28.45,41.25 28.25,41.45 28.25,44.09 27.84,44.5 v27.43,44.5
M18
  Top 0.203: ATF1502.20 27.27,42.84 28.04,42.06 29.87,42.06 31.29,40.64 31.29,39.01 31.5,38.81 35.36,38.81 35.56,39.01 35.56,39.42 35.76,39.62 37.22,39.62 ROM.1
SWD_CLK  (via drill 0.3 pad 0.3)
  Top 0.203: JP1.8 58.52,28.85 58.93,28.45 58.93,25.2 58.12,24.38 58.12,9.55 55.07,6.5 55.07,1.63 54.05,0.61 37.59,0.61 37.39,0.81 v37.39,1.83 | v37.39,3.86 37.39,7.32 42.47,12.39 43.74,12.39 KE04Z128.42
  Top 0.406: R6.1 57,28.85 JP1.8
  Bottom 0.203: v37.39,1.83 v37.39,3.86
SWD_DIO  (via drill 0.3 pad 0.3)
  Top 0.203: JP1.7 55.68,31.5 55.07,30.89 v55.07,30.28 | v42.27,1.83 54.05,1.83 54.25,2.03 54.25,6.91 57.3,9.96 57.3,22.76 55.07,24.99 v55.07,27.64 | v42.27,3.86 42.27,10.36 42.67,10.77 43.72,10.77 KE04Z128.44
  Bottom 0.203: v42.27,1.83 v42.27,3.86 | v55.07,27.64 v55.07,30.28
TCK
  Top 0.203: ATF1502.26 22.12,47.12 23.16,48.16 53.24,48.16 55.07,46.33 55.07,44.5 55.37,44.2 JP1.2
TDI  (via drill 0.3 pad 0.3)
  Top 0.203: ATF1502.1 16.52,38.27 17.27,39.01 v17.27,41.05 | v25.6,47.35 26.01,47.75 53.03,47.75 54.66,46.13 54.66,42.47 55.47,41.66 JP1.3
  Bottom 0.203: v17.27,41.05 17.27,41.25 17.68,41.66 25.4,41.66 25.6,41.86 v25.6,47.35
TDO
  Top 0.203: ATF1502.32 17.32,47.19 18.69,48.56 53.44,48.56 55.27,46.74 JP1.1
TMS  (via drill 0.3 pad 0.3)
  Top 0.203: ATF1502.7 v21.32,41.03 21.34,41.05 | v26.21,46.74 26.82,47.35 52.83,47.35 54.25,45.92 54.25,40.44 55.58,39.12 JP1.4
  Bottom 0.203: v21.32,41.03 26,41.03 26.21,41.25 v26.21,46.74
XA0  (via drill 0.3 pad 0.3)
  Top 0.203: SRAM.37 29.05,22.14 31.09,24.18 36.78,24.18 v37.19,23.77 | KE04Z128.26 51.18,18.87 51,18.69 46.02,18.69 44.81,19.91 v44.81,22.86
  Bottom 0.203: v44.81,22.86 38.1,22.86 v37.19,23.77
XA1  (via drill 0.3 pad 0.3)
  Top 0.203: SRAM.36 29.83,22.11 31.29,23.57 36.37,23.57 v36.98,22.96 | KE04Z128.25 51.98,18.66 51.61,18.29 45.82,18.29 44.2,19.91 v44.2,22.15
  Bottom 0.203: v36.98,22.96 37.8,22.15 v44.2,22.15
XA2  (via drill 0.3 pad 0.3)
  Top 0.203: SRAM.35 30.62,22.09 31.5,22.96 35.97,22.96 v36.78,22.15 | v53.54,23.16 52.73,22.35 52.73,20.68 KE04Z128.24
  Bottom 0.203: v36.78,22.15 37.39,21.54 44.5,21.54 46.13,23.16 v53.54,23.16
XA3  (via drill 0.3 pad 0.3)
  Top 0.203: SRAM.34 31.41,21.86 31.9,22.35 35.56,22.35 v36.58,21.34 | v53.54,21.95 53.54,20.67 KE04Z128.23
  Bottom 0.203: v36.58,21.34 36.78,21.13 44.7,21.13 46.13,22.55 53.34,22.55 53.54,22.35 v53.54,21.95
XA4  (via drill 0.3 pad 0.3)
  Top 0.203: SRAM.33 32.19,21.43 32.51,21.74 35.15,21.74 v38.2,18.69 | 55.04,18.9 KE04Z128.22 55.34,18.8 53.65,18.8 53.54,18.69 v53.44,18.69
  Bottom 0.203: v38.2,18.69 v53.44,18.69
XA5  (via drill 0.3 pad 0.3)
  Top 0.203: SRAM.32 34.1,18.86 34.14,18.9 v36.37,18.9 | v54.05,18.09 55.33,18.09 KE04Z128.21
  Bottom 0.203: v36.37,18.9 36.78,18.9 37.59,18.09 v54.05,18.09
XA6  (via drill 0.3 pad 0.3)
  Top 0.203: SRAM.31 38.42,18.07 40.84,15.65 v40.84,14.43 | v54.05,11.58 55.33,11.58 KE04Z128.13
  Bottom 0.203: v40.84,14.43 53.03,14.43 53.24,14.22 53.24,12.39 v54.05,11.58
XA7  (via drill 0.3 pad 0.3)
  Top 0.203: SRAM.30 37.99,17.29 40.23,15.04 v40.23,13.82 | v52.83,11.79 52.83,11.68 53.75,10.77 55.32,10.77 KE04Z128.12
  Bottom 0.203: v40.23,13.82 52.43,13.82 52.83,13.41 v52.83,11.79
XA8  (via drill 0.3 pad 0.3)
  Top 0.203: SRAM.29 34.1,16.5 34.14,16.46 37.59,16.46 39.62,14.43 v39.62,13.21 | v52.22,12.8 52.22,11.18 52.83,10.57 52.83,9.09 KE04Z128.10
  Bottom 0.203: v39.62,13.21 51.82,13.21 v52.22,12.8
XA9  (via drill 0.3 pad 0.3)
  Top 0.203: SRAM.28 37.12,15.71 39.01,13.82 v39.01,12.39 | v51.41,12.39 51.41,10.97 52.02,10.36 52.02,9.07 KE04Z128.9
  Bottom 0.203: v39.01,12.39 v51.41,12.39
XA10  (via drill 0.3 pad 0.3)
  Top 0.203: KE04Z128.20 55.11,17.23 55.07,17.27 v54.05,17.27 | v36.37,14.94 34.06,14.94 SRAM.27
  Bottom 0.203: v54.05,17.27 36.78,17.27 36.37,16.87 v36.37,14.94
XA11  (via drill 0.3 pad 0.3)
  Top 0.203: KE04Z128.19 55.09,16.43 55.07,16.46 v54.05,16.46 | v36.98,14.12 34.06,14.12 SRAM.26
  Bottom 0.203: v54.05,16.46 37.19,16.46 36.98,16.26 v36.98,14.12
XA12  (via drill 0.3 pad 0.3)
  Top 0.203: SRAM.25 34.28,13.35 34.34,13.41 v38.2,13.41 | v54.05,13.21 55.35,13.21 KE04Z128.15
  Bottom 0.203: v38.2,13.41 38.2,14.63 38.61,15.04 53.24,15.04 53.65,14.63 53.65,13.61 v54.05,13.21
XD0  (via drill 0.3 pad 0.3)
  Top 0.203: SRAM.10 v27.47,6.54 | v46.33,7.72 46.33,8.98 KE04Z128.2
  Bottom 0.203: v27.47,6.54 28,6.54 28.45,6.1 45.92,6.1 46.33,6.5 v46.33,7.72
XD1  (via drill 0.3 pad 0.3)
  Top 0.203: v45.52,7.72 45.52,8.97 KE04Z128.1 | SRAM.11 28.26,7.1 v28.25,7.11
  Bottom 0.203: v45.52,7.72 45.52,6.91 45.11,6.5 29.46,6.5 28.85,7.11 v28.25,7.11
XD2  (via drill 0.3 pad 0.3)
  Top 0.203: SRAM.12 29.05,7.91 v29.06,7.72 | v47.14,21.95 47.14,20.67 KE04Z128.31
  Bottom 0.203: v29.06,7.72 29.06,8.94 34.54,14.43 34.54,19.91 35.36,20.73 46.74,20.73 47.14,21.13 v47.14,21.95
XD3  (via drill 0.3 pad 0.3)
  Top 0.203: v30.58,7.21 30.58,5.23 SRAM.14 | v47.95,21.95 47.95,20.66 KE04Z128.30
  Bottom 0.203: v30.58,7.21 30.58,9.86 34.95,14.22 34.95,19.71 35.56,20.32 47.55,20.32 47.95,20.73 v47.95,21.95
XD4  (via drill 0.3 pad 0.3)
  Top 0.203: SRAM.15 31.39,5.21 31.39,5.99 31.19,6.2 v31.19,8.13 | v48.77,21.95 48.77,20.65 KE04Z128.29
  Bottom 0.203: v31.19,8.13 31.19,9.86 35.36,14.02 35.36,19.51 35.76,19.91 48.36,19.91 48.77,20.32 v48.77,21.95
XD5  (via drill 0.3 pad 0.3)
  Top 0.203: SRAM.16 32.19,6.01 32,6.2 v32,7.21 | v54.05,15.65 55.37,15.65 KE04Z128.18
  Bottom 0.203: v32,7.21 32,10.06 35.36,13.41 37.39,13.41 37.59,13.61 37.59,15.34 37.9,15.65 v54.05,15.65
XD6  (via drill 0.3 pad 0.3)
  Top 0.203: KE04Z128.17 51.82,14.83 48.16,11.18 45.62,11.18 43.18,8.74 v43.18,7.11 | v35.36,7.11 34.11,7.11 SRAM.17
  Bottom 0.203: v43.18,7.11 v35.36,7.11
XD7  (via drill 0.3 pad 0.3)
  Top 0.203: KE04Z128.16 51.63,14.03 48.36,10.77 45.82,10.77 43.79,8.74 v43.79,7.82 | v35.97,7.82 34.06,7.82 SRAM.18
  Bottom 0.203: v43.79,7.82 v35.97,7.82
XMS
  Top 0.406: SRAM.40 26.68,21.81 27.03,22.15 28.2,22.15 R2.2

### Text on the board
tNames: www.happydaze.se | Wolf rev.D